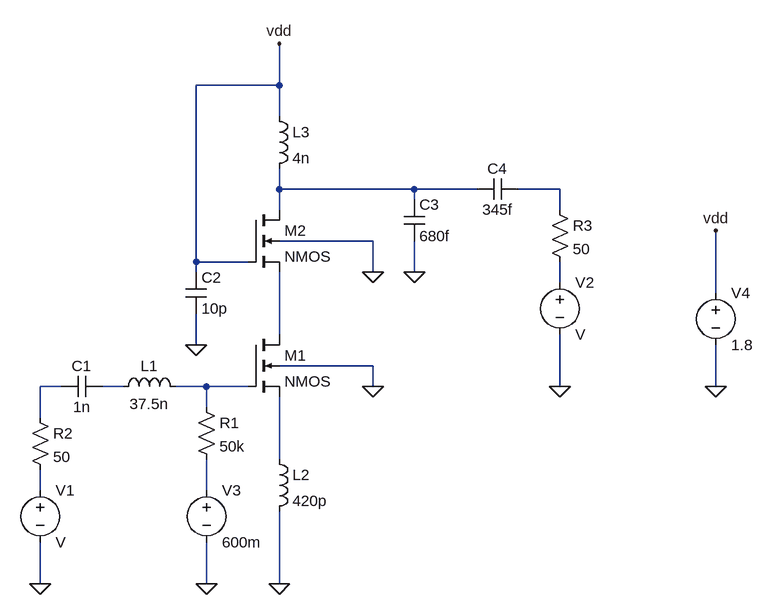
[diagram p0: schematic LNA_DESIGN.asc]
LNA_DESIGN.asc, the LTspice schematic file:
Version 4
SHEET 1 1040 680
WIRE 304 -240 304 -304
WIRE 304 -240 176 -240
WIRE 304 -192 304 -240
WIRE 304 -80 304 -112
WIRE 512 -80 304 -80
WIRE 608 -80 512 -80
WIRE 736 -80 672 -80
WIRE 512 -64 512 -80
WIRE 304 -48 304 -80
WIRE 736 -48 736 -80
WIRE 448 0 304 0
WIRE 176 32 176 -240
WIRE 256 32 176 32
WIRE 176 48 176 32
WIRE 448 48 448 0
WIRE 512 48 512 0
WIRE 736 64 736 32
WIRE 976 80 976 -16
WIRE 304 144 304 48
WIRE 176 160 176 112
WIRE 448 192 304 192
WIRE -32 224 -64 224
WIRE 64 224 32 224
WIRE 192 224 144 224
WIRE 256 224 192 224
WIRE 448 224 448 192
WIRE 736 224 736 144
WIRE 976 224 976 160
WIRE 192 256 192 224
WIRE -64 272 -64 224
WIRE 304 336 304 240
WIRE -64 384 -64 352
WIRE 192 384 192 336
WIRE -64 528 -64 464
WIRE 192 528 192 464
WIRE 304 528 304 416
FLAG -64 528 0
FLAG 192 528 0
FLAG 304 528 0
FLAG 448 224 0
FLAG 448 48 0
FLAG 512 48 0
FLAG 736 224 0
FLAG 976 224 0
FLAG 176 160 0
FLAG 976 -16 vdd
FLAG 304 -304 vdd
SYMBOL cap 32 208 R90
WINDOW 0 0 32 VBottom 2
WINDOW 3 32 32 VTop 2
SYMATTR InstName C1
SYMATTR Value 1n
SYMBOL ind 48 240 R270
WINDOW 0 32 56 VTop 2
WINDOW 3 5 56 VBottom 2
SYMATTR InstName L1
SYMATTR Value 37.5n
SYMBOL res 176 240 R0
SYMATTR InstName R1
SYMATTR Value 50k
SYMBOL res -80 256 R0
SYMATTR InstName R2
SYMATTR Value 50
SYMBOL ind 288 320 R0
SYMATTR InstName L2
SYMATTR Value 420p
SYMBOL nmos4 256 144 R0
SYMATTR InstName M1
SYMBOL nmos4 256 -48 R0
SYMATTR InstName M2
SYMBOL ind 288 -208 R0
SYMATTR InstName L3
SYMATTR Value 4n
SYMATTR SpiceLine Rser=5
SYMBOL cap 160 48 R0
SYMATTR InstName C2
SYMATTR Value 10p
SYMBOL cap 496 -64 R0
SYMATTR InstName C3
SYMATTR Value 680f
SYMBOL cap 672 -96 R90
WINDOW 0 0 32 VBottom 2
WINDOW 3 32 32 VTop 2
SYMATTR InstName C4
SYMATTR Value 345f
SYMBOL res 720 -64 R0
SYMATTR InstName R3
SYMATTR Value 50
SYMBOL voltage -64 368 R0
SYMATTR InstName V1
SYMBOL voltage 736 48 R0
SYMATTR InstName V2
SYMBOL voltage 192 368 R0
WINDOW 123 0 0 Left 0
WINDOW 39 0 0 Left 0
SYMATTR InstName V3
SYMATTR Value 600m
SYMBOL voltage 976 64 R0
WINDOW 123 0 0 Left 0
WINDOW 39 0 0 Left 0
SYMATTR InstName V4
SYMATTR Value 1.8

The netlist it stands for:
* LNA_DESIGN.asc
C1 N006 N005 1n
L1 N006 N007 37.5n
R1 N007 N010 50k
R2 N005 N009 50
L2 N008 0 420p
M1 N004 N007 N008 0 NMOS
M2 N001 vdd N004 0 NMOS
L3 vdd N001 4n Rser=5
C2 vdd 0 10p
C3 N001 0 680f
C4 N002 N001 345f
R3 N002 N003 50
V1 N009 0 V
V2 N003 0 V
V3 N010 0 600m
V4 vdd 0 1.8
.model NMOS NMOS
.model PMOS PMOS
.lib standard.mos
.backanno
.end